# EAGLE design pcb schematic (EAGLE 9.6.2)
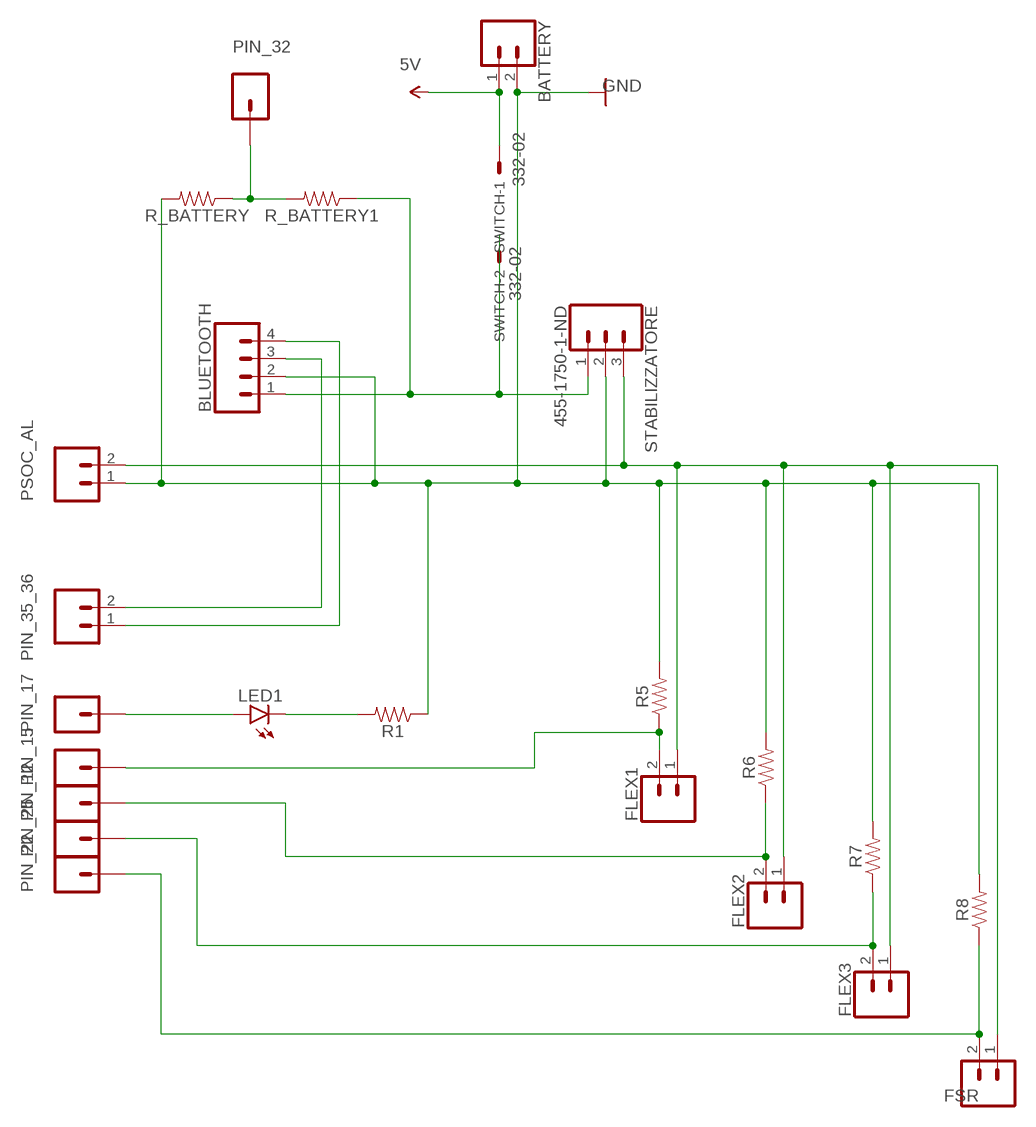
[diagram p0: schematic, sheet 1]

## Parts
BATTERY  CONN_02  [1X02]
BLUETOOTH  CONN_04  [1X04]
FLEX1  CONN_02  [1X02]
FLEX2  CONN_02  [1X02]
FLEX3  CONN_02  [1X02]
FSR  CONN_02  [1X02]
LED1  LED5MM  [LED5MM]
PIN_12  CONN_01  [1X01]
PIN_15  CONN_01  [1X01]
PIN_17  CONN_01  [1X01]
PIN_22  CONN_01  [1X01]
PIN_25  CONN_01  [1X01]
PIN_32  CONN_01  [1X01]
PIN_35_36  CONN_02  [1X02]
PSOC_AL  CONN_02  [1X02]
R1  RESISTORAXIAL-0.3  [AXIAL-0.3]
R5  RESISTORAXIAL-0.3  [AXIAL-0.3]
R6  RESISTORAXIAL-0.3  [AXIAL-0.3]
R7  RESISTORAXIAL-0.3  [AXIAL-0.3]
R8  RESISTORAXIAL-0.3  [AXIAL-0.3]
R_BATTERY  RESISTORAXIAL-0.3  [AXIAL-0.3]
R_BATTERY1  RESISTORAXIAL-0.3  [AXIAL-0.3]
STABILIZZATORE  455-1750-1-ND  CONN_03  [1X03]
SWITCH  332-02  [332-02]

## Nets
5V: BATTERY.1 SWITCH.1
GND: BATTERY.2 BLUETOOTH.2 PSOC_AL.1 R1.P$1 R5.P$2 R6.P$2 R7.P$2 R8.P$2 R_BATTERY.P$2 STABILIZZATORE.2
N$1: FLEX1.2 PIN_15.1 R5.P$1
N$2: FLEX2.2 PIN_12.1 R6.P$1
N$3: FLEX3.2 PIN_25.1 R7.P$1
N$4: BLUETOOTH.3 PIN_35_36.2
N$5: FSR.2 PIN_22.1 R8.P$1
N$6: BLUETOOTH.4 PIN_35_36.1
N$7: LED1.A PIN_17.1
N$8: LED1.K(C) R1.P$2
N$9: PIN_32.1 R_BATTERY1.P$2 R_BATTERY.P$1
N$10: BLUETOOTH.1 R_BATTERY1.P$1 STABILIZZATORE.1 SWITCH.2
N$12: FLEX1.1 FLEX2.1 FLEX3.1 FSR.1 PSOC_AL.2 STABILIZZATORE.3

## Library data of the parts
BATTERY FLEX1-FLEX3 FSR PIN_35_36 PSOC_AL = SparkFun-Connectors:CONN_02: Multi connection point. Often used as Generic Header-pin footprint for 0.1 inch spaced/style header connections On any of the 0.1 inch spaced packages, you can populate with these: Break Away Headers - Straight <https://www.sparkfun.com/products/116> (PRT-00116) Break Away Male Headers - Right Angle <https://www.sparkfun.com/products/553> (PRT-00553) Female Headers <https://www.sparkfun.com/products/115> (PRT-00115) Break Away Headers - Machine Pin <https://www.sparkfun.com/products/117> (PRT-00117) Break Away Female Headers - Swiss Machine Pin <https://www.sparkfun.com/products/743> (PRT-00743) For SCREWTERMINALS and SPRING TERMINALS visit here: Screw Terimnals on SparkFun.com <https://www.sparkfun.com/search/results?term=Screw+Terminals> (5mm/3.5mm/2.54mm spacing) This device is also useful as a general connection point to wire up your design to another part of your project. Our various solder wires solder well into these plated through hole pads. Hook-Up Wire - Assortment (Stranded, 22 AWG) <https://www.sparkfun.com/products/11375> (PRT-11375) Hook-Up Wire - Assortment (Solid Core, 22 AWG) <https://www.sparkfun.com/products/11367> (PRT-11367) View the entire wire category on our website here <https://www.sparkfun.com/categories/141> Special notes: Molex polarized connector foot print use with: PRT-08233 with associated crimp pins and housings. 2.54_SCREWTERM for use with PRT-10571. 3.5mm Screw Terminal footprints for PRT-08084 5mm Screw Terminal footprints for use with PRT-08432
BLUETOOTH = SparkFun-Connectors:CONN_04: Multi connection point. Often used as Generic Header-pin footprint for 0.1 inch spaced/style header connections On any of the 0.1 inch spaced packages, you can populate with these: Break Away Headers - Straight <https://www.sparkfun.com/products/116> (PRT-00116) Break Away Male Headers - Right Angle <https://www.sparkfun.com/products/553> (PRT-00553) Female Headers <https://www.sparkfun.com/products/115> (PRT-00115) Break Away Headers - Machine Pin <https://www.sparkfun.com/products/117> (PRT-00117) Break Away Female Headers - Swiss Machine Pin <https://www.sparkfun.com/products/743> (PRT-00743) For SCREWTERMINALS and SPRING TERMINALS visit here: Screw Terimnals on SparkFun.com <https://www.sparkfun.com/search/results?term=Screw+Terminals> (5mm/3.5mm/2.54mm spacing) This device is also useful as a general connection point to wire up your design to another part of your project. Our various solder wires solder well into these plated through hole pads. Hook-Up Wire - Assortment (Stranded, 22 AWG) <https://www.sparkfun.com/products/11375> (PRT-11375) Hook-Up Wire - Assortment (Solid Core, 22 AWG) <https://www.sparkfun.com/products/11367> (PRT-11367) View the entire wire category on our website here <https://www.sparkfun.com/categories/141> Special notes: Molex polarized connector foot print use with SKU : PRT-08231 with associated crimp pins and housings. 1MM SMD Version SKU: PRT-10208; PROD_ID: CONN-09696
LED1 = led:LED: LED OSRAM: - CHIPLED LG R971, LG N971, LY N971, LG Q971, LY Q971, LO R971, LY R971 LH N974, LH R974 LS Q976, LO Q976, LY Q976 LO Q996 - Hyper CHIPLED LW Q18S LB Q993, LB Q99A, LB R99A - SideLED LS A670, LO A670, LY A670, LG A670, LP A670 LB A673, LV A673, LT A673, LW A673 LH A674 LY A675 LS A676, LA A676, LO A676, LY A676, LW A676 LS A679, LY A679, LG A679 - Hyper Micro SIDELED® LS Y876, LA Y876, LO Y876, LY Y876 LT Y87S - SmartLED LW L88C, LW L88S LB L89C, LB L89S, LG L890 LS L89K, LO L89K, LY L89K LS L896, LA L896, LO L896, LY L896 - TOPLED LS T670, LO T670, LY T670, LG T670, LP T670 LSG T670, LSP T670, LSY T670, LOP T670, LYG T670 LG T671, LOG T671, LSG T671 LB T673, LV T673, LT T673, LW T673 LH T674 LS T676, LA T676, LO T676, LY T676, LB T676, LH T676, LSB T676, LW T676 LB T67C, LV T67C, LT T67C, LS T67K, LO T67K, LY T67K, LW E67C LS E67B, LA E67B, LO E67B, LY E67B, LB E67C, LV E67C, LT E67C LW T67C LS T679, LY T679, LG T679 LS T770, LO T770, LY T770, LG T770, LP T770 LB T773, LV T773, LT T773, LW T773 LH T774 LS E675, LA E675, LY E675, LS T675 LS T776, LA T776, LO T776, LY T776, LB T776 LHGB T686 LT T68C, LB T68C - Hyper Mini TOPLED® LB M676 - Mini TOPLED Santana® LG M470 LS M47K, LO M47K, LY M47K Source: http://www.osram.convergy.de LUXEON: - LUMILED® LXK2-PW12-R00, LXK2-PW12-S00, LXK2-PW14-U00, LXK2-PW14-V00 LXK2-PM12-R00, LXK2-PM12-S00, LXK2-PM14-U00 LXK2-PE12-Q00, LXK2-PE12-R00, LXK2-PE12-S00, LXK2-PE14-T00, LXK2-PE14-U00 LXK2-PB12-K00, LXK2-PB12-L00, LXK2-PB12-M00, LXK2-PB14-N00, LXK2-PB14-P00, LXK2-PB14-Q00 LXK2-PR12-L00, LXK2-PR12-M00, LXK2-PR14-Q00, LXK2-PR14-R00 LXK2-PD12-Q00, LXK2-PD12-R00, LXK2-PD12-S00 LXK2-PH12-R00, LXK2-PH12-S00 LXK2-PL12-P00, LXK2-PL12-Q00, LXK2-PL12-R00 Source: www.luxeon.com KINGBRIGHT: KA-3528ASYC Source: www.kingbright.com
PIN_12 PIN_15 PIN_17 PIN_22 PIN_25 PIN_32 = SparkFun-Connectors:CONN_01: Single connection point. Often used as Generic Header-pin footprint for 0.1 inch spaced/style header connections On any of the 0.1 inch spaced packages, you can populate with these: Break Away Headers - Straight <https://www.sparkfun.com/products/116> (PRT-00116) Break Away Male Headers - Right Angle <https://www.sparkfun.com/products/553> (PRT-00553) Female Headers <https://www.sparkfun.com/products/115> (PRT-00115) Break Away Headers - Machine Pin <https://www.sparkfun.com/products/117> (PRT-00117) Break Away Female Headers - Swiss Machine Pin <https://www.sparkfun.com/products/743> (PRT-00743) This device is also useful as a general connection point to wire up your design to another part of your project. Our various solder wires solder well into these plated through hole pads. Hook-Up Wire - Assortment (Stranded, 22 AWG) <https://www.sparkfun.com/products/11375> (PRT-11375) Hook-Up Wire - Assortment (Solid Core, 22 AWG) <https://www.sparkfun.com/products/11367> (PRT-11367) View the entire wire category on our website here <https://www.sparkfun.com/categories/141> Special notes: SMTSO-256-ET is a "flush mount" nut for a 4-40 screw. We mostly use this on specialty testbeds; it is a nice way to connect hardware to your PCB at an adjustable hieght. Also note, the SNAP packages are for using a snappable style connector. We sell a baggie of snaps and they are also used on two LilyPad designs: Snap Assortment - 30 pack (male and female) <https://www.sparkfun.com/products/11347> (DEV-11347) LilyPad Arduino SimpleSnap <https://www.sparkfun.com/products/10941> (DEV-10941) LilyPad SimpleSnap Protoboard <https://www.sparkfun.com/products/10940> (DEV-10940)
R1 R5-R8 R_BATTERY R_BATTERY1 = SparkFun-Resistors:RESISTOR: Generic Resistor Package
STABILIZZATORE = SparkFun-Connectors:CONN_03: Multi connection point. Often used as Generic Header-pin footprint for 0.1 inch spaced/style header connections On any of the 0.1 inch spaced packages, you can populate with these: Break Away Headers - Straight <https://www.sparkfun.com/products/116> (PRT-00116) Break Away Male Headers - Right Angle <https://www.sparkfun.com/products/553> (PRT-00553) Female Headers <https://www.sparkfun.com/products/115> (PRT-00115) Break Away Headers - Machine Pin <https://www.sparkfun.com/products/117> (PRT-00117) Break Away Female Headers - Swiss Machine Pin <https://www.sparkfun.com/products/743> (PRT-00743) Stackable Header - 3 Pin (Female, 0.1") <https://www.sparkfun.com/products/13875> (PRT-13875) For SCREWTERMINALS and SPRING TERMINALS visit here: Screw Terimnals on SparkFun.com <https://www.sparkfun.com/search/results?term=Screw+Terminals> (5mm/3.5mm/2.54mm spacing) This device is also useful as a general connection point to wire up your design to another part of your project. Our various solder wires solder well into these plated through hole pads. Hook-Up Wire - Assortment (Stranded, 22 AWG) <https://www.sparkfun.com/products/11375> (PRT-11375) Hook-Up Wire - Assortment (Solid Core, 22 AWG) <https://www.sparkfun.com/products/11367> (PRT-11367) View the entire wire category on our website here <https://www.sparkfun.com/categories/141> Special notes: Molex polarized connector foot print use with SKU : PRT-08232 with associated crimp pins and housings.; PROD_ID: XXX-00000
SWITCH = con-garry:332-02: 2 Pin - 2mm Dual Row Source: www.mpe-connector.de / garry_shortform_2012.pdf

## Board
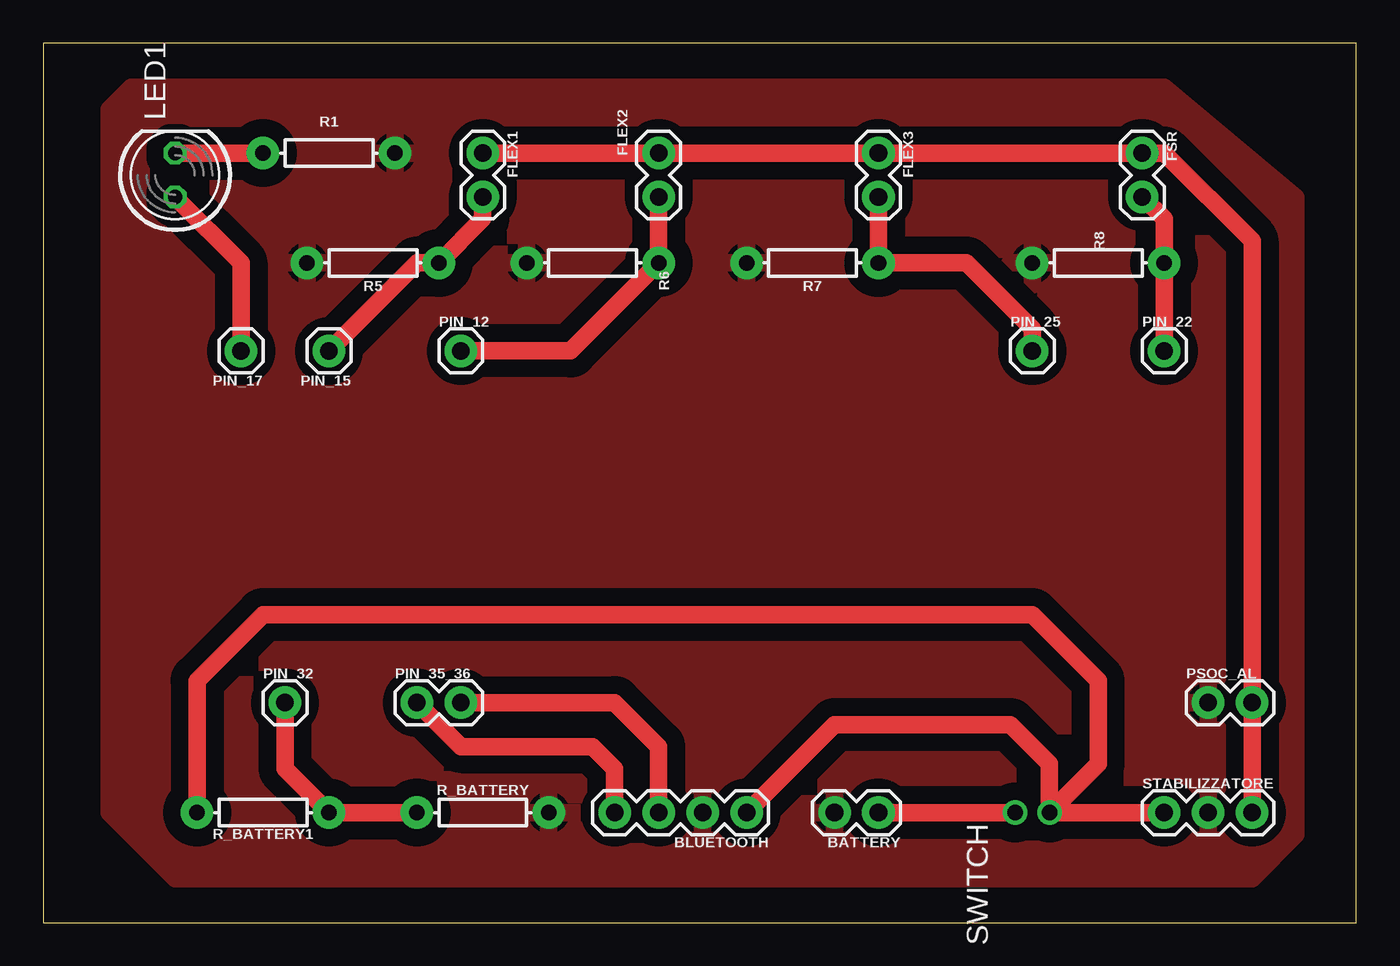
[diagram p1: board, top side]
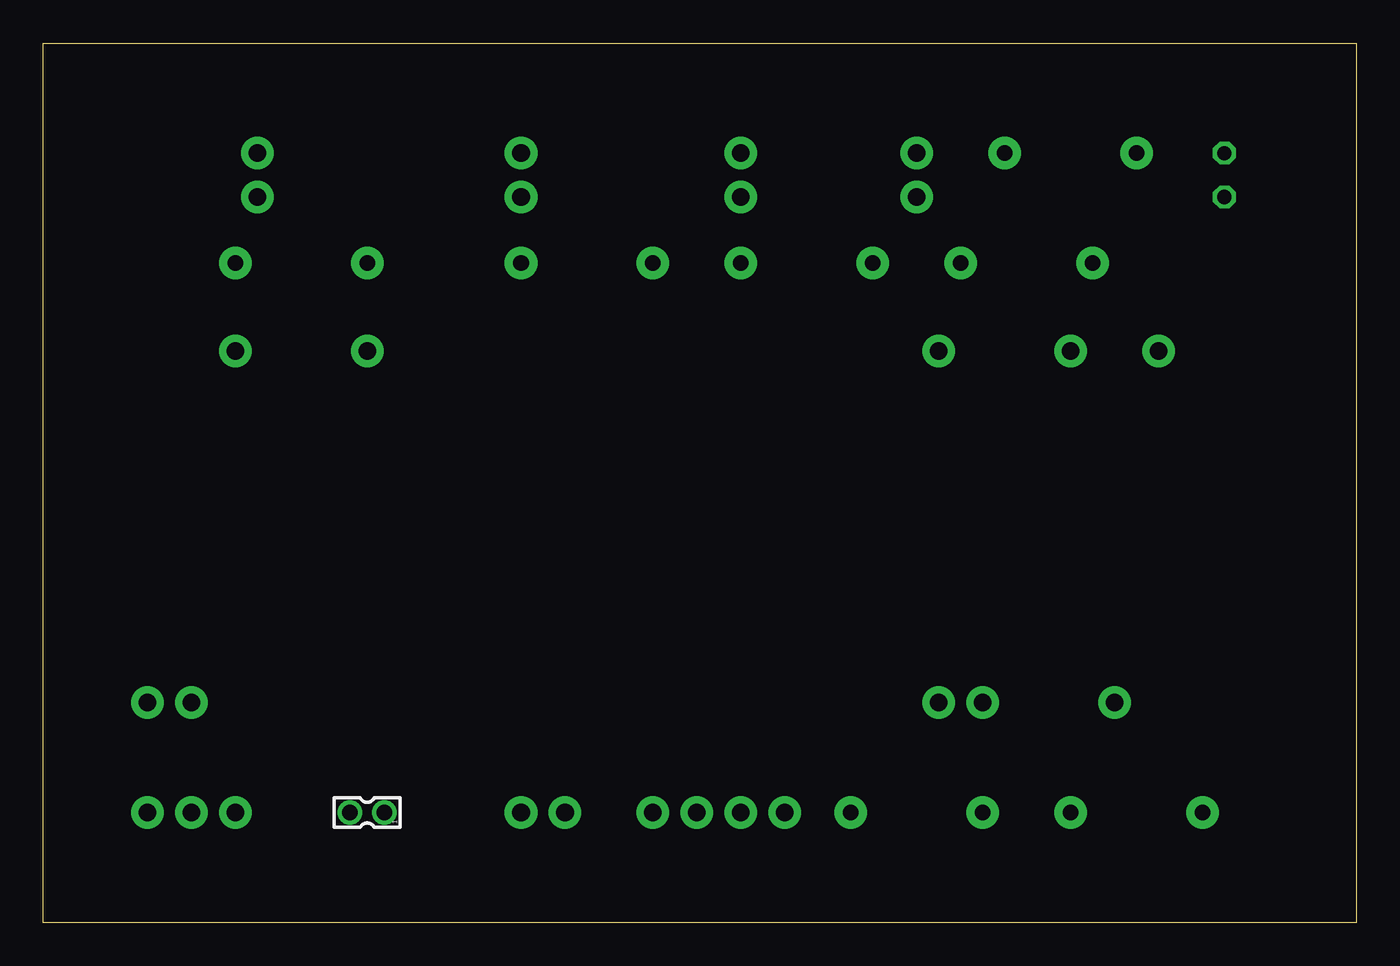
[diagram p2: board, bottom side, seen from below]

Size 75.87 x 50.79 mm. Coordinates in mm from the lower left corner, seen from the top.
Outline: 0,0 75.87,0 75.87,50.79 0,50.79 0,0
Copper layers (1*16): Top 0.035mm / dielectric 1.5mm / Bottom 0.035mm
Design rules "default": minimum track width 6mil, minimum drill 0.35mm, track to track 6mil, track to pad 6mil, pad to pad 6mil, via to via 6mil, smd to smd 6mil, copper to edge 40mil, drill to drill 6mil, minimum pad ring 10mil, minimum via ring 8mil, stop-mask expansion 4mil, vias tented up to drill 0mil, thermal gap 10mil

### Footprints (pad centres in the part's own frame; a part is rotated, then mirrored left to right if it is on the bottom)
1X02 = drill 1.016 pad 1.88: 1 0,0; 2 2.54,0
1X04 = drill 1.016 pad 1.88: 1 0,0; 2 2.54,0; 3 5.08,0; 4 7.62,0
LED5MM = drill 0.813 octagon: A -1.27,0; K 1.27,0
1X01 = drill 1.016 pad 1.88: 1 0,0
AXIAL-0.3 = drill 0.9 pad 1.88: P$1 -3.81,0; P$2 3.81,0
1X03 = drill 1.016 pad 1.88: 1 0,0; 2 2.54,0; 3 5.08,0
332-02 = drill 0.9 pad 1.27: 1 0,-1; 2 0,1

### Placement (x,y rotation side)
BATTERY  48.26,6.35 180 top
BLUETOOTH  40.64,6.35 180 top
FLEX1  25.4,44.45 270 top
FLEX2  35.56,44.45 270 top
FLEX3  48.26,44.45 270 top
FSR  63.5,44.45 270 top
LED1  7.62,43.18 90 top
PIN_12  24.13,33.02 0 top
PIN_15  16.51,33.02 180 top
PIN_17  11.43,33.02 180 top
PIN_22  64.77,33.02 0 top
PIN_25  57.15,33.02 0 top
PIN_32  13.97,12.7 0 top
PIN_35_36  21.59,12.7 0 top
PSOC_AL  67.31,12.7 0 top
R1  16.51,44.45 180 top
R5  19.05,38.1 180 top
R6  31.75,38.1 180 top
R7  44.45,38.1 180 top
R8  60.96,38.1 180 top
R_BATTERY  25.4,6.35 0 top
R_BATTERY1  12.7,6.35 0 top
STABILIZZATORE  64.77,6.35 0 top
SWITCH  57.15,6.35 90 bottom

### Tracks (layer width: path | path; a pad name or v marks a point on that pad's centre or on a via)
5V
  Top 1.016: SWITCH.1 BATTERY.1
GND
  pour Top (isolate 1.016): 3.81,46.99 3.81,6.35 7.62,2.54 69.85,2.54 72.39,5.08 72.39,41.91 64.77,48.26 5.08,48.26
N$1
  Top 1.016: FLEX1.2 25.4,40.64 R5.P$1 21.59,38.1 PIN_15.1
N$2
  Top 1.016: FLEX2.2 R6.P$1 30.48,33.02 PIN_12.1
N$3
  Top 1.016: FLEX3.2 R7.P$1 53.34,38.1 57.15,34.29 PIN_25.1
N$4
  Top 1.016: PIN_35_36.2 33.02,12.7 35.56,10.16 BLUETOOTH.3
N$5
  Top 1.016: FSR.2 64.77,40.64 R8.P$1 PIN_22.1
N$6
  Top 1.016: BLUETOOTH.4 33.02,8.89 31.75,10.16 24.13,10.16 PIN_35_36.1
N$7
  Top 1.016: LED1.A 11.43,38.1 PIN_17.1
N$8
  Top 1.016: LED1.K R1.P$2
N$9
  Top 1.016: PIN_32.1 13.97,8.89 R_BATTERY1.P$2 R_BATTERY.P$1
N$10
  Top 1.016: STABILIZZATORE.1 SWITCH.2 | SWITCH.2 58.15,9.16 55.88,11.43 45.72,11.43 BLUETOOTH.1 | R_BATTERY1.P$1 8.89,13.97 12.7,17.78 57.15,17.78 60.96,13.97 60.96,9.16 SWITCH.2
N$12
  Top 1.016: STABILIZZATORE.3 PSOC_AL.2 69.85,39.37 64.77,44.45 FSR.1 FLEX3.1 FLEX2.1 FLEX1.1